# Altium project prj.PrjPCB
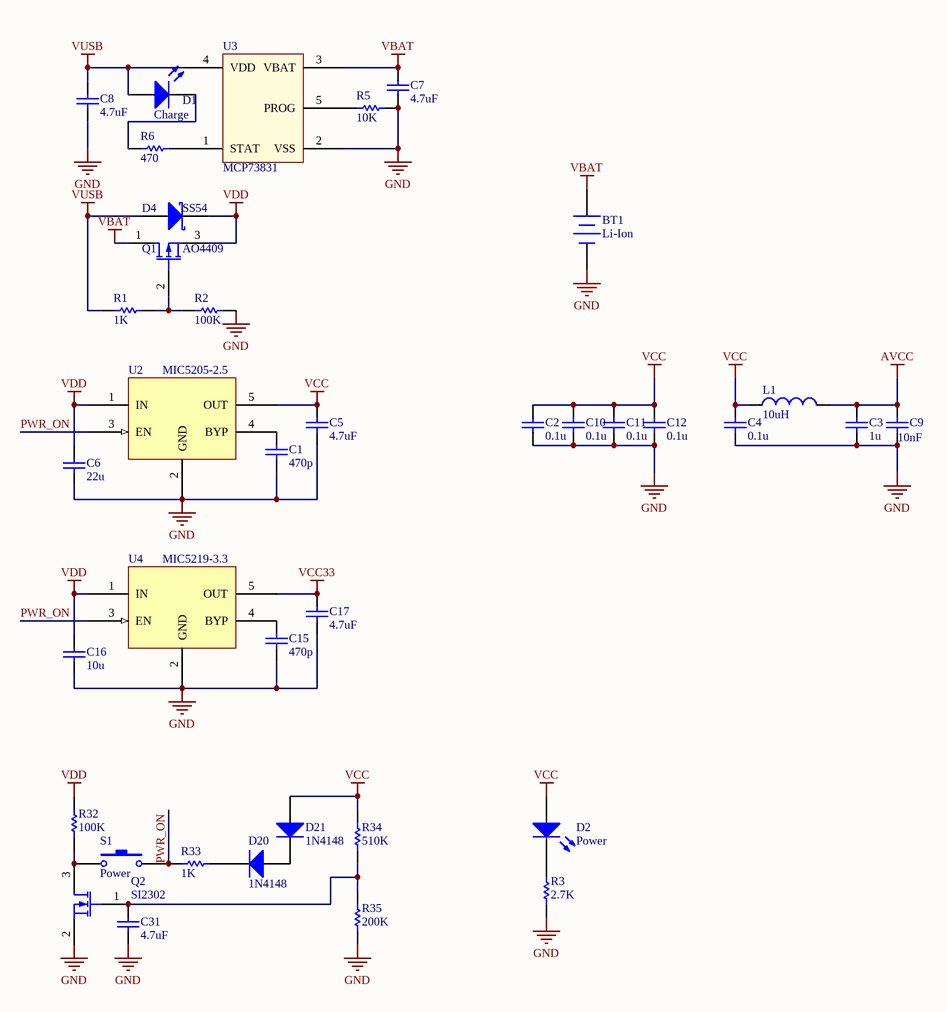
[diagram p0: sch_power.SchDoc]
4 sheets, 104 parts. Net scope: global (net labels, ports and power ports of the same name join across sheets).
Board file: PCB.PcbDoc
Sheets:
  sch_power.SchDoc
  sch_sensor.SchDoc
  sch_output.SchDoc
  sch_mcu.SchDoc

## Sheet sch_power.SchDoc
size A4

### Parts
BT1  Li-Ion  [HDR1X2]
C1  value 470p  [C-1608[0603]]  (hidden comment: Cap Semi)
C2  value 0.1u  [C-1608[0603]]  (hidden comment: Cap Semi)
C3  value 1u  [C-1608[0603]]  (hidden comment: Cap Semi)
C4  value 0.1u  [C-1608[0603]]  (hidden comment: Cap Semi)
C5  value 4.7uF  [C-1608[0603]]  (hidden comment: Cap Semi)
C6  value 22u  [C-2012[0805]]  (hidden comment: Cap Semi)
C7  value 4.7uF  [C-1608[0603]]  (hidden comment: Cap Semi)
C8  value 4.7uF  [C-1608[0603]]  (hidden comment: Cap Semi)
C9  value 10nF  [C-1608[0603]]  (hidden comment: Cap Semi)
C10  value 0.1u  [C-1608[0603]]  (hidden comment: Cap Semi)
C11  value 0.1u  [C-1608[0603]]  (hidden comment: Cap Semi)
C12  value 0.1u  [C-1608[0603]]  (hidden comment: Cap Semi)
C15  value 470p  [C-1608[0603]]  (hidden comment: Cap Semi)
C16  value 10u  [C-2012[0805]]  (hidden comment: Cap Semi)
C17  value 4.7uF  [C-1608[0603]]  (hidden comment: Cap Semi)
C31  value 4.7uF  [C-1608[0603]]  (hidden comment: Cap Semi)
D1  Charge  [LED-1608[0603]-R]
D2  Power  [LED-1608[0603]-G]
D4  SS54  [DO-214AA]
D20  1N4148  [SOD80C]
D21  1N4148  [SOD80C]
L1  value 10uH  [L-1608[0603]]  (hidden comment: Inductor)
Q1  AO4409  [SOP8-MOS]
Q2  SI2302  [SOT23B]
R1  value 1K  [R-1608[0603]]  (hidden comment: Res Semi)
R2  value 100K  [R-1608[0603]]  (hidden comment: Res Semi)
R3  value 2.7K  [R-1608[0603]]  (hidden comment: Res Semi)
R5  value 10K  [R-1608[0603]]  (hidden comment: Res Semi)
R6  value 470  [R-1608[0603]]  (hidden comment: Res Semi)
R32  value 100K  [R-1608[0603]]  (hidden comment: Res Semi)
R33  value 1K  [R-1608[0603]]  (hidden comment: Res Semi)
R34  value 510K  [R-1608[0603]]  (hidden comment: Res Semi)
R35  value 200K  [R-1608[0603]]  (hidden comment: Res Semi)
S1  Power  [TS-015]
U2  MIC5205-2.5  [SOT23-5]
U3  MCP73831  [SOT23-5]
U4  MIC5219-3.3  [SOT23-5]

### Nets
AVCC: C3.2 C9.2 L1.2
GND: BT1.2(-) C1.2 C2.1 C3.1 C4.1 C5.2 C6.2 C7.1 C8.1 C9.1 C10.1 C11.1 C12.1 C15.2 C16.2 C17.2 C31.1 Q2.2(S) R2.2 R3.2 R5.1 R35.1 U2.2(GND) U3.2(VSS) U4.2(GND)
VBAT: BT1.1(+) C7.2 Q1.1(D) U3.3(VBAT)
VCC: C2.2 C4.2 C5.1 C10.2 C11.2 C12.2 D2.1(A) D21.1(A) L1.1 R34.2 U2.5(OUT)
VCC33: C17.1 U4.5(OUT)
VDD: C6.1 C16.1 D4.2(K) Q1.3(S) R32.2 U2.1(IN) U4.1(IN)
VUSB: C8.2 D1.1(A) D4.1(A) R1.1 U3.4(VDD)
PWR_ON: R33.2 S1.2 U2.3(EN) U4.3(EN)
NetC1_1: C1.1 U2.4(BYP)
NetC15_1: C15.1 U4.4(BYP)
NetC31_2: C31.2 Q2.1(G) R34.1 R35.2
NetD1_2: D1.2(K) R6.1
NetD2_2: D2.2(K) R3.1
NetD20_1: D20.1(A) D21.2(K)
NetD20_2: D20.2(K) R33.1
NetQ1_2: Q1.2(G) R1.2 R2.1
NetQ2_3: Q2.3(D) R32.1 S1.1
NetR5_2: R5.2 U3.5(PROG)
NetR6_2: R6.2 U3.1(STAT)

### Library data of the parts
BT1 = Battery: Multicell Battery; Published: 24-Mar-1999; LatestRevisionDate: 17-Jul-2002; LatestRevisionNote: Re-released for DXP Platform.; PackageReference: BAT-2; Publisher: Altium Limited
C1-C12 C15-C17 C31 = Cap Semi: Capacitor (Semiconductor SIM Model); Published: 8-Jun-2000; PackageReference: C1206; Publisher: Altium Limited
  C1 C5 C6 C15-C17: LatestRevisionDate: 29-May-2009; LatestRevisionNote: IPC-7351 Footprint Added.; PackageDescription: Chip Capacitor
  C2-C4 C7-C12 C31: LatestRevisionDate: 17-Jul-2002; LatestRevisionNote: Re-released for DXP Platform.
D1 D2 = LED2: Typical RED, GREEN, YELLOW, AMBER GaAs LED; Published: 8-Jun-2000; LatestRevisionDate: 17-Jul-2002; LatestRevisionNote: Re-released for DXP Platform.; PackageDocument: Feb-2002; PackageReference: 3.2X1.6X1.1; Publisher: Altium Limited
D4 = D Schottky: Schottky Diode; Published: 8-Jun-2000; LatestRevisionDate: 17-Jul-2002; LatestRevisionNote: Re-released for DXP Platform.; Publisher: Altium Limited
D20 D21 = Diode 1N4148: High Conductance Fast Diode; Published: 8-Jun-2000; LatestRevisionDate: 17-Jul-2002; LatestRevisionNote: Re-released for DXP Platform.; DatasheetDocument: 1997; PackageReference: DO-35; Publisher: Altium Limited; Code_JEDEC: DO-204-AH; ComponentLink1Description: Manufacturer Link; ComponentLink1URL: http://www.fairchildsemi.com/; ComponentLink2Description: Datasheet; ComponentLink2URL: http://www.fairchildsemi.com/ds/1N%2F1N4148.pdf
L1 = Inductor: Code_IEC: 1005; Published: 8-Jun-2000; LatestRevisionDate: 17-Jul-2002; LatestRevisionNote: Re-released for DXP Platform.; PackageReference: 0402-A; Publisher: Altium Limited; Code_JEITA: 0402
Q1 = MOSFET-P: P-Channel MOSFET; pin to pad: 1>D 2>G 3>S; PackageDocument: 1995/1996; Published: 8-Jun-2000; LatestRevisionDate: 17-Jul-2002; LatestRevisionNote: Re-released for DXP Platform.; PackageReference: E3; Publisher: Altium Limited
Q2 = SI2302: N-Channel MOSFET; Published: 8-Jun-2000; LatestRevisionDate: 17-Jul-2002; LatestRevisionNote: Re-released for DXP Platform.; PackageVersion: 1995/1996; PackageReference: E3; Publisher: Altium Limited
R1-R3 R5 R6 R32-R35 = Res Semi: Semiconductor Resistor; Published: 8-Jun-2000; LatestRevisionDate: 17-Jul-2002; LatestRevisionNote: Re-released for DXP Platform.; PackageReference: AXIAL-0.5; Publisher: Altium Limited
  R3 R32-R35: PackageDescription: Axial Device, Thru-Hole; 2 Leads; 0.5 in Pin Spacing
S1 = SW-PB: Switch; Published: 24-Mar-1999; LatestRevisionDate: 17-Jul-2002; LatestRevisionNote: Re-released for DXP Platform.; PackageReference: SPST-2; Publisher: Altium Limited
U2 U4 = MIC5219: 500mA-Peak Output LDO Regulator
U3 = MCP73831: Miniature Single-Cell, Fully Integrated Li-Ion, Li-Polymer Charge Management Controllers

## Sheet sch_sensor.SchDoc
size A4
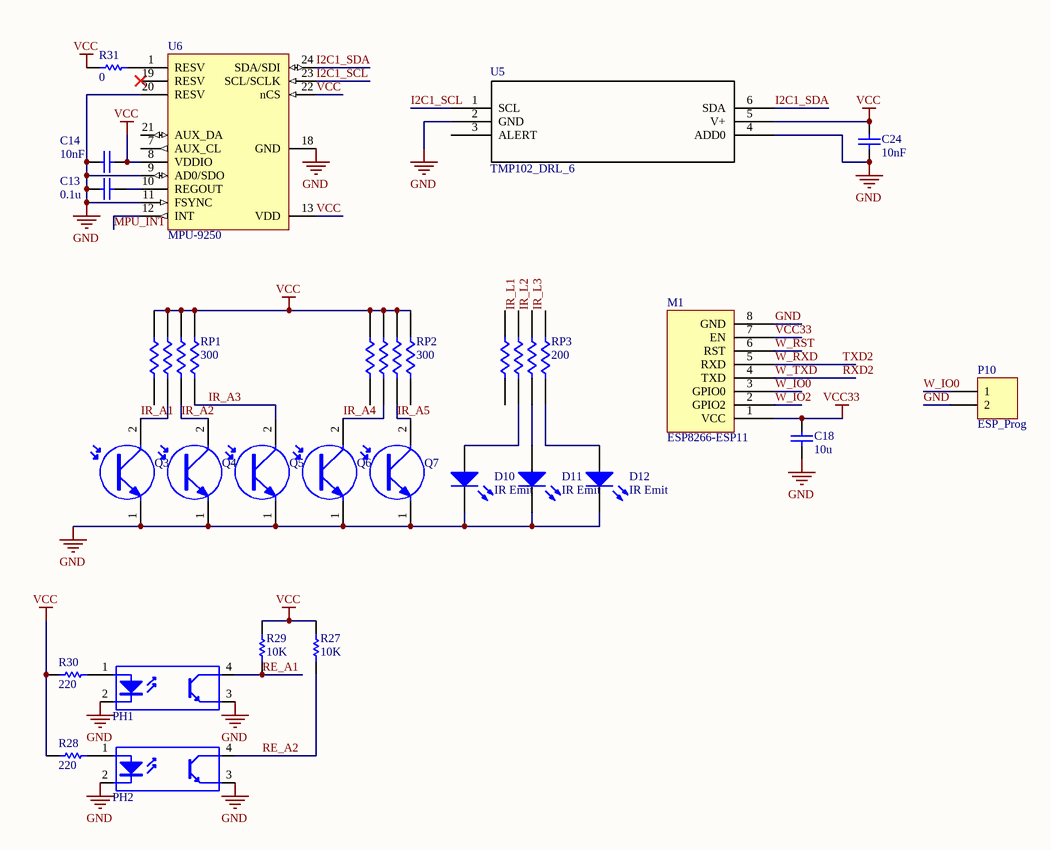
[diagram p1: sch_sensor.SchDoc]

### Parts
C13  value 0.1u  [C-1608[0603]]  (hidden comment: Cap Semi)
C14  value 10nF  [C-1608[0603]]  (hidden comment: Cap Semi)
C18  value 10u  [C-1608[0603]]  (hidden comment: Cap Semi)
C24  value 10nF  [C-1608[0603]]  (hidden comment: Cap Semi)
D10  IR Emit  [LED-0]
D11  IR Emit  [LED-0]
D12  IR Emit  [LED-0]
M1  ESP8266-ESP11  [ESP8266-ESP11]
P10  ESP_Prog  [EDGE_1]
PH1  Optoisolator1  [RPR359F]  (value not drawn)
PH2  Optoisolator1  [RPR359F]  (value not drawn)
Q3  IR_Photo_NPN  [PHOTO_NPN]  (value not drawn)
Q4  IR_Photo_NPN  [PHOTO_NPN]  (value not drawn)
Q5  IR_Photo_NPN  [PHOTO_NPN]  (value not drawn)
Q6  IR_Photo_NPN  [PHOTO_NPN]  (value not drawn)
Q7  IR_Photo_NPN  [PHOTO_NPN]  (value not drawn)
R27  value 10K  [R-1608[0603]]  (hidden comment: Res Semi)
R28  value 220  [R-1608[0603]]  (hidden comment: Res Semi)
R29  value 10K  [R-1608[0603]]  (hidden comment: Res Semi)
R30  value 220  [R-1608[0603]]  (hidden comment: Res Semi)
R31  value 0  [R-1608[0603]]  (hidden comment: Res Semi)
RP1  300  [R0603x4]
RP2  300  [R0603x4]
RP3  200  [R0603x4]
U5  TMP102_DRL_6  [DRL6]
U6  MPU-9250  [MPU9250]

### Nets
GND: C13.2 C14.2 C18.1 C24.2 D10.2(K) D11.2(K) D12.2(K) M1.8(GND) P10.2 PH1.2(K) PH1.3(E) PH2.2(K) PH2.3(E) Q3.1(E) Q4.1(E) Q5.1(E) Q6.1(E) Q7.1(E) U5.2(GND) U5.4(ADD0) U6.9(AD0/SDO) U6.11(FSYNC) U6.18(GND) U6.20(RESV)
VCC: C14.1 C24.1 R27.2 R28.2 R29.2 R30.2 R31.1 RP1.1 RP1.2 RP1.3 RP1.4 RP2.1 RP2.2 RP2.3 RP2.4 U5.5(V+) U6.8(VDDIO) U6.13(VDD) U6.22(nCS)
VCC33: C18.2 M1.1(VCC) M1.7(EN)
I2C1_SCL: U5.1(SCL) U6.23(SCL/SCLK)
I2C1_SDA: U5.6(SDA) U6.24(SDA/SDI)
IR_A1: Q3.2(C) RP1.6
IR_A2: Q4.2(C) RP1.7
IR_A3: Q5.2(C) RP1.8
IR_A4: Q6.2(C) RP2.6
IR_A5: Q7.2(C) RP2.7
IR_L1: RP3.3
IR_L2: RP3.2
IR_L3: RP3.1
MPU_INT: U6.12(INT)
RE_A1: PH1.4(C) R29.1
RE_A2: PH2.4(C) R27.1
RXD2: M1.4(TXD)  [also labelled W_TXD]
TXD2: M1.5(RXD)  [also labelled W_RXD]
W_IO0: M1.3(GPIO0) P10.1
W_IO2: M1.2(GPIO2)
W_RST: M1.6(RST)
NetC13_1: C13.1 U6.10(REGOUT)
NetD10_1: D10.1(A) RP3.6
NetD11_1: D11.1(A) RP3.7
NetD12_1: D12.1(A) RP3.8
NetPH1_1: PH1.1(A) R30.1
NetPH2_1: PH2.1(A) R28.1
NetR31_2: R31.2 U6.1(RESV)

Not connected (* = marked no-connect by the designer): RP1 5; RP2 5 8; RP3 4 5; U5 3(ALERT); U6 7(AUX_CL) 19(RESV)* 21(AUX_DA)

### Library data of the parts
C13 C14 C18 C24 = Cap Semi: Capacitor (Semiconductor SIM Model); Published: 8-Jun-2000; LatestRevisionDate: 17-Jul-2002; LatestRevisionNote: Re-released for DXP Platform.; PackageReference: C1206; Publisher: Altium Limited
D10-D12 = LED0: Typical INFRARED GaAs LED; Published: 8-Jun-2000; LatestRevisionDate: 08-Jul-2005; LatestRevisionNote: Mech Layer 1 removed.; PackageReference: LED-0; Publisher: Altium Limited; PackageDescription: LED; 2 Leads
P10 = Header 2: Header, 2-Pin; LatestRevisionDate: 17-Jul-2002; LatestRevisionNote: Re-released for DXP Platform.; Publisher: Altium Limited
PH1 PH2 = Optoisolator1: 4-Pin Phototransistor Optocoupler; Published: 24-Mar-1999; LatestRevisionDate: 04-Mar-2005; LatestRevisionNote: Sch pins 3 & 4 Swapped.; DatasheetVersion: Nov-2003; PackageReference: DIP-4; Publisher: Altium Limited
Q3-Q7 = IR_Photo_NPN: NPN Phototransistor; Published: 24-Mar-1999; LatestRevisionDate: 17-Jul-2002; LatestRevisionNote: Re-released for DXP Platform.; PackageReference: TO-220_A; Publisher: Altium Limited; Code_JEDEC: TO-220-AC
R27-R31 = Res Semi: Semiconductor Resistor; Published: 8-Jun-2000; LatestRevisionDate: 17-Jul-2002; LatestRevisionNote: Re-released for DXP Platform.; PackageReference: AXIAL-0.5; Publisher: Altium Limited
  R27-R30: PackageDescription: Axial Device, Thru-Hole; 2 Leads; 0.5 in Pin Spacing
RP1-RP3 = RPACK4
U5 = TMP102_DRL_6: Imported; GENERIC_PART_NUMBER: TMP102; Vendor: Texas Instruments; PACKAGE_DESIGNATOR: DRL; PIN_COUNT: 6; FAMILY_NAME: TEMPERATURE SENSOR; INDUSTRY_STD_PKG_TYPE: SOT; Manufacturer_Part_Number: tmp102_drl_6; Datasheet URL: http://www.ti.com/lit/gpn/TMP102; Manufacturer: Texas Instruments; RefDes: RefDes; Type: DEV; Value: Value
U6 = MPU-9250: Integrated 6-axis MotionTracking device
M1 = ESP8266-ESP11: Value: http://item.taobao.com/item.htm?id=41802488823

## Sheet sch_output.SchDoc
size A4
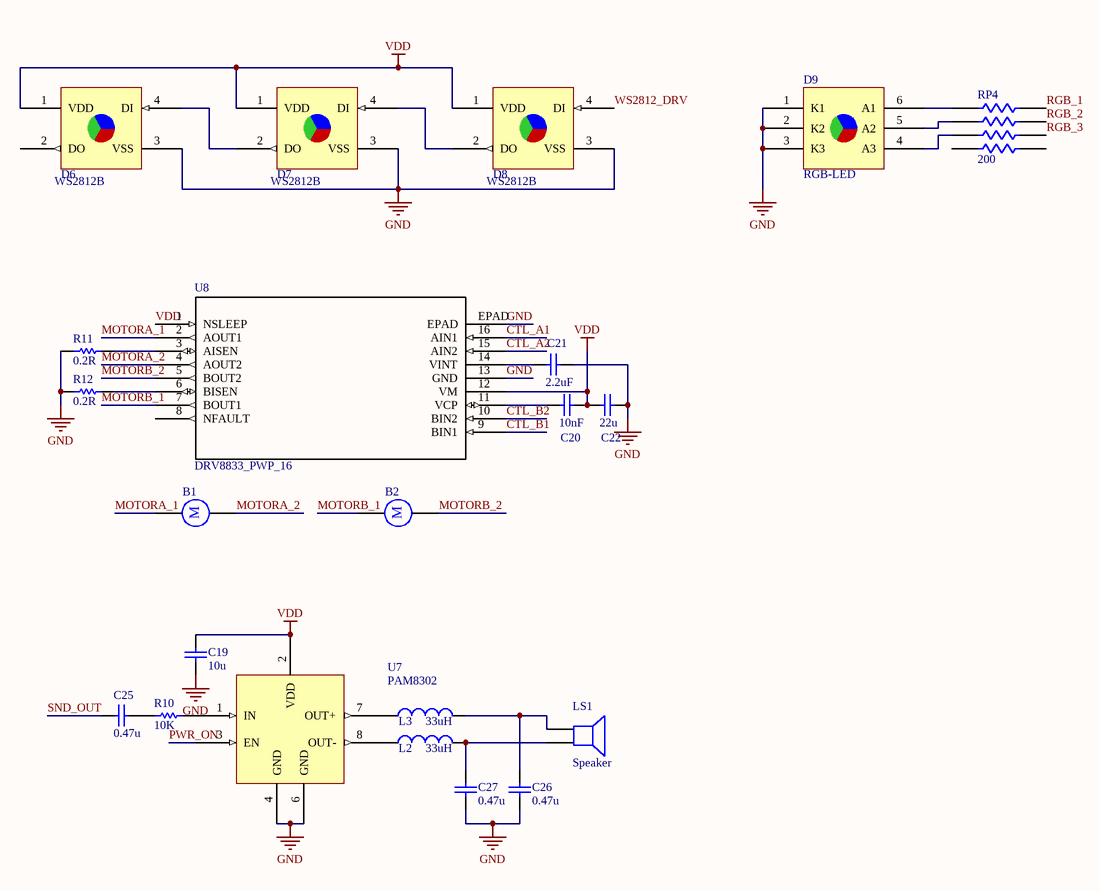
[diagram p2: sch_output.SchDoc]

### Parts
B1  Motor  [RB5-10.5]  (value not drawn)
B2  Motor  [RB5-10.5]  (value not drawn)
C19  value 10u  [C-2012[0805]]  (hidden comment: Cap Semi)
C20  value 10nF  [C-1608[0603]]  (hidden comment: Cap Semi)
C21  value 2.2uF  [C-1608[0603]]  (hidden comment: Cap Semi)
C22  value 22u  [C-2012[0805]]  (hidden comment: Cap Semi)
C25  value 0.47u  [C-1608[0603]]  (hidden comment: Cap Semi)
C26  value 0.47u  [C-1608[0603]]  (hidden comment: Cap Semi)
C27  value 0.47u  [C-1608[0603]]  (hidden comment: Cap Semi)
D6  WS2812B  [LED-5050-4]
D7  WS2812B  [LED-5050-4]
D8  WS2812B  [LED-5050-4]
D9  RGB-LED  [LED-5050-6]
L2  value 33uH  [L-1608[0603]]  (hidden comment: Inductor)
L3  value 33uH  [L-1608[0603]]  (hidden comment: Inductor)
LS1  Speaker  [PIN2]
R10  value 10K  [R-1608[0603]]  (hidden comment: Res Semi)
R11  value 0.2R  [R-3216[1206]]  (hidden comment: Res Semi)
R12  value 0.2R  [R-3216[1206]]  (hidden comment: Res Semi)
RP4  200  [R0603x4]
U7  PAM8302  [SOP8-3D]
U8  DRV8833_PWP_16  [PWP16_2P31X2P46]

### Nets
GND: C19.1 C21.1 C22.2 C26.2 C27.2 D6.3(VSS) D7.3(VSS) D8.3(VSS) D9.1(K1) D9.2(K2) D9.3(K3) R11.1 R12.1 U7.4(GND) U7.6(GND) U8.13(GND) U8.EPAD
VDD: C19.2 C20.1 C22.1 D6.1(VDD) D7.1(VDD) D8.1(VDD) U7.2(VDD) U8.1(NSLEEP) U8.12(VM)
CTL_A1: U8.16(AIN1)
CTL_A2: U8.15(AIN2)
CTL_B1: U8.9(BIN1)
CTL_B2: U8.10(BIN2)
MOTORA_1: B1.1 U8.2(AOUT1)
MOTORA_2: B1.2 U8.4(AOUT2)
MOTORB_1: B2.1 U8.7(BOUT1)
MOTORB_2: B2.2 U8.5(BOUT2)
PWR_ON: U7.3(EN)
RGB_1: RP4.8
RGB_2: RP4.7
RGB_3: RP4.6
SND_OUT: C25.2
WS2812_DRV: D8.4(DI)
NetC20_2: C20.2 U8.11(VCP)
NetC21_2: C21.2 U8.14(VINT)
NetC25_1: C25.1 R10.2
NetC26_1: C26.1 L3.2 LS1.1
NetC27_1: C27.1 L2.2 LS1.2
NetD6_4: D6.4(DI) D7.2(DO)
NetD7_4: D7.4(DI) D8.2(DO)
NetD9_4: D9.4(A3) RP4.3
NetD9_5: D9.5(A2) RP4.2
NetD9_6: D9.6(A1) RP4.1
NetL2_1: L2.1 U7.8(OUT-)
NetL3_1: L3.1 U7.7(OUT+)
NetR10_1: R10.1 U7.1(IN)
NetR11_2: R11.2 U8.3(AISEN)
NetR12_2: R12.2 U8.6(BISEN)

Not connected (* = marked no-connect by the designer): D6 2(DO); RP4 4 5; U8 8(NFAULT)

### Notes on the sheet
- (in symbol Motor) M

### Library data of the parts
B1 B2 = Motor: Motor, General Kind; Published: 24-Mar-1999; LatestRevisionDate: 17-Jul-2002; LatestRevisionNote: Re-released for DXP Platform.; PackageReference: RB5-10.5; Publisher: Altium Limited; PackageDescription: Capacitor (Radial); 2 Leads
C19-C22 C25-C27 = Cap Semi: Capacitor (Semiconductor SIM Model); Published: 8-Jun-2000; PackageReference: C1206; Publisher: Altium Limited
  C19 C22: LatestRevisionDate: 29-May-2009; LatestRevisionNote: IPC-7351 Footprint Added.; PackageDescription: Chip Capacitor
  C20 C21 C25-C27: LatestRevisionDate: 17-Jul-2002; LatestRevisionNote: Re-released for DXP Platform.
D9 = RGBLED
L2 L3 = Inductor: Code_IEC: 1005; Published: 8-Jun-2000; LatestRevisionDate: 17-Jul-2002; LatestRevisionNote: Re-released for DXP Platform.; PackageReference: 0402-A; Publisher: Altium Limited; Code_JEITA: 0402
LS1 = Speaker: Loudspeaker; Published: 24-Mar-1999; LatestRevisionDate: 17-Jul-2002; LatestRevisionNote: Re-released for DXP Platform.; PackageReference: PIN2; Publisher: Altium Limited
R10-R12 = Res Semi: Semiconductor Resistor; Published: 8-Jun-2000; LatestRevisionDate: 17-Jul-2002; LatestRevisionNote: Re-released for DXP Platform.; PackageReference: AXIAL-0.5; Publisher: Altium Limited
RP4 = RPACK4
U8 = DRV8833_PWP_16: Imported; Manufacturer: Texas Instruments; INDUSTRY_STD_PKG_TYPE: HTSSOP; FAMILY_NAME: BRUSHED DC DRIVER; PIN_COUNT: 16; PACKAGE_DESIGNATOR: PWP; Datasheet URL: http://www.ti.com/lit/gpn/DRV8833; GENERIC_PART_NUMBER: DRV8833; Vendor: Texas Instruments; Manufacturer_Part_Number: drv8833_pwp_16; RefDes: RefDes; Type: DEV; Value: Value

## Sheet sch_mcu.SchDoc
size A4
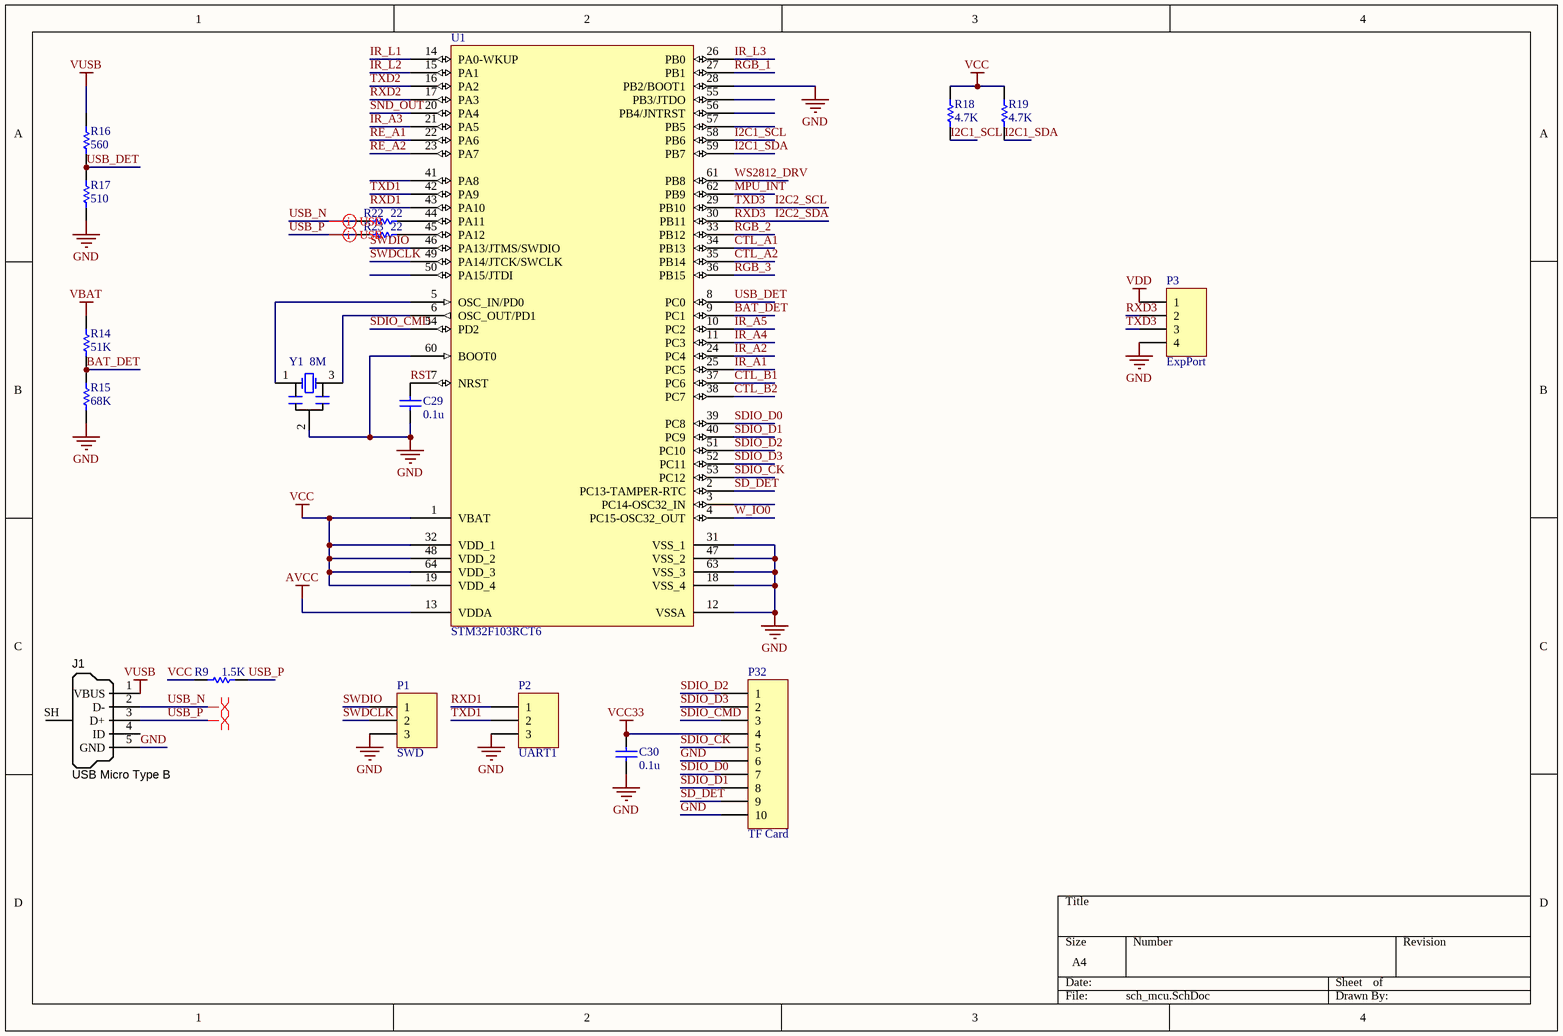
[diagram p3: sch_mcu.SchDoc]

### Parts
C29  value 0.1u  [C-1608[0603]]  (hidden comment: Cap Semi)
C30  value 0.1u  [C-1608[0603]]  (hidden comment: Cap Semi)
J1  USB Micro Type B  [MICRO USB 3D]
P1  SWD  [HDR1X3]
P2  UART1  [HDR1X3]
P3  ExpPort  [HDR1X4]
P32  TF Card  [MicroSD auto]
R9  value 1.5K  [R-1608[0603]]  (hidden comment: Res Semi)
R14  value 51K  [R-1608[0603]]  (hidden comment: Res Semi)
R15  value 68K  [R-1608[0603]]  (hidden comment: Res Semi)
R16  value 560  [R-1608[0603]]  (hidden comment: Res Semi)
R17  value 510  [R-1608[0603]]  (hidden comment: Res Semi)
R18  value 4.7K  [R-1608[0603]]  (hidden comment: Res Semi)
R19  value 4.7K  [R-1608[0603]]  (hidden comment: Res Semi)
R22  value 22  [R-1608[0603]]  (hidden comment: Res Semi)
R23  value 22  [R-1608[0603]]  (hidden comment: Res Semi)
U1  STM32F103RCT6  [TQFP64_N-3D]
Y1  8M  [Crystal_C]

### Nets
AVCC: U1.13(VDDA)
GND: C29.1 C30.1 J1.5(GND) P1.3 P2.3 P3.4 P32.6 P32.10 R15.2 R17.1 U1.12(VSSA) U1.18(VSS_4) U1.28(PB2/BOOT1) U1.31(VSS_1) U1.47(VSS_2) U1.60(BOOT0) U1.63(VSS_3) Y1.2(GND)
VBAT: R14.2
VCC: R9.2 R18.2 R19.2 U1.1(VBAT) U1.19(VDD_4) U1.32(VDD_1) U1.48(VDD_2) U1.64(VDD_3)
VCC33: C30.2 P32.4
VDD: P3.1
VUSB: J1.1(VBUS) R16.2
BAT_DET: R14.1 R15.1 U1.9(PC1)
CTL_A1: U1.34(PB13)
CTL_A2: U1.35(PB14)
CTL_B1: U1.37(PC6)
CTL_B2: U1.38(PC7)
I2C1_SCL: R18.1 U1.58(PB6)
I2C1_SDA: R19.1 U1.59(PB7)
I2C2_SCL: P3.3 U1.29(PB10)  [also labelled TXD3]
I2C2_SDA: P3.2 U1.30(PB11)  [also labelled RXD3]
IR_A1: U1.25(PC5)
IR_A2: U1.24(PC4)
IR_A3: U1.21(PA5)
IR_A4: U1.11(PC3)
IR_A5: U1.10(PC2)
IR_L1: U1.14(PA0-WKUP)
IR_L2: U1.15(PA1)
IR_L3: U1.26(PB0)
MPU_INT: U1.62(PB9)
RE_A1: U1.22(PA6)
RE_A2: U1.23(PA7)
RGB_1: U1.27(PB1)
RGB_2: U1.33(PB12)
RGB_3: U1.36(PB15)
RST: C29.2 U1.7(NRST)
RXD1: P2.1 U1.43(PA10)
RXD2: U1.17(PA3)
SD_DET: P32.9 U1.2(PC13-TAMPER-RTC)
SDIO_CK: P32.5 U1.53(PC12)
SDIO_CMD: P32.3 U1.54(PD2)
SDIO_D0: P32.7 U1.39(PC8)
SDIO_D1: P32.8 U1.40(PC9)
SDIO_D2: P32.1 U1.51(PC10)
SDIO_D3: P32.2 U1.52(PC11)
SND_OUT: U1.20(PA4)
SWDCLK: P1.2 U1.49(PA14/JTCK/SWCLK)
SWDIO: P1.1 U1.46(PA13/JTMS/SWDIO)
TXD1: P2.2 U1.42(PA9)
TXD2: U1.16(PA2)
USB_DET: R16.1 R17.2 U1.8(PC0)
USB_N: J1.2(D-) R22.1
USB_P: J1.3(D+) R9.1 R23.1
W_IO0: U1.4(PC15-OSC32_OUT)
WS2812_DRV: U1.61(PB8)
NetR22_2: R22.2 U1.44(PA11)
NetR23_2: R23.2 U1.45(PA12)
NetU1_5: U1.5(OSC_IN/PD0) Y1.1(OSC1)
NetU1_6: U1.6(OSC_OUT/PD1) Y1.3(OSC2)

Not connected (* = marked no-connect by the designer): J1 4(ID) SH(Shell); U1 3(PC14-OSC32_IN) 41(PA8) 50(PA15/JTDI) 55(PB3/JTDO) 56(PB4/JNTRST) 57(PB5)

### Layout directives
differential pair: USB_N, USB_P

### Library data of the parts
C29 C30 = Cap Semi: Capacitor (Semiconductor SIM Model); Published: 8-Jun-2000; LatestRevisionDate: 17-Jul-2002; LatestRevisionNote: Re-released for DXP Platform.; PackageReference: C1206; Publisher: Altium Limited
J1 = USB_Micro_TypeB: Connector SMD USB Micro Type B middle mount; Manufacturer 1: Molex Inc; Manufacturer Part Number 1: 47491-0001; SCDType: undef; Package / Case: SMD; Supplier 1: Digi-Key; Supplier Part Number 1: WM17142CT-ND
P1 P2 = Header 3: Header, 3-Pin; LatestRevisionDate: 17-Jul-2002; LatestRevisionNote: Re-released for DXP Platform.; Publisher: Altium Limited
P3 = Header 4: Header, 4-Pin; LatestRevisionDate: 17-Jul-2002; LatestRevisionNote: Re-released for DXP Platform.; Publisher: Altium Limited
P32 = Header 10: Header, 10-Pin; LatestRevisionDate: 17-Jul-2002; LatestRevisionNote: Re-released for DXP Platform.; Publisher: Altium Limited
R9 R14-R19 R22 R23 = Res Semi: Semiconductor Resistor; Published: 8-Jun-2000; LatestRevisionDate: 17-Jul-2002; LatestRevisionNote: Re-released for DXP Platform.; PackageReference: AXIAL-0.5; Publisher: Altium Limited
U1 = STM32F103RBT6: STM32 ARM-based 32-bit MCU High-density; Published: 30-May-2008; DatasheetVersion: rev6, Mar-2008; PackageVersion: Mar-2008; PackageReference: LQFP64; Publisher: Altium Limited; PackageDescription: 64-Pin Low-Profile Quad Flat Pack, 10 x 10 mm Body, 0.5 mm Pitch (LQFP64); ComponentLink1Description: Manufacturer Link; ComponentLink1URL: www.st.com/stm32; ComponentLink2Description: Datasheet; ComponentLink2URL: http://www.st.com/stonline/products/literature/ds/13587.pdf
Y1 = XTAL_C: Crystal Oscillator; Published: 8-Jun-2000; LatestRevisionDate: 17-Jul-2002; LatestRevisionNote: Re-released for DXP Platform.; PackageReference: R38; Publisher: Altium Limited

## Nets that join several sheets
AVCC: sch_power (C3.2 C9.2 L1.2), sch_mcu (U1.13)
GND: sch_power (25 pins), sch_sensor (24 pins), sch_output (17 pins), sch_mcu (18 pins)
VBAT: sch_power (BT1.1 C7.2 Q1.1 U3.3), sch_mcu (R14.2)
VCC: sch_power (11 pins), sch_sensor (19 pins), sch_mcu (8 pins)
VCC33: sch_power (C17.1 U4.5), sch_sensor (C18.2 M1.1 M1.7), sch_mcu (C30.2 P32.4)
VDD: sch_power (7 pins), sch_output (9 pins), sch_mcu (P3.1)
VUSB: sch_power (5 pins), sch_mcu (J1.1 R16.2)
CTL_A1: sch_output (U8.16), sch_mcu (U1.34)
CTL_A2: sch_output (U8.15), sch_mcu (U1.35)
CTL_B1: sch_output (U8.9), sch_mcu (U1.37)
CTL_B2: sch_output (U8.10), sch_mcu (U1.38)
I2C1_SCL: sch_sensor (U5.1 U6.23), sch_mcu (R18.1 U1.58)
I2C1_SDA: sch_sensor (U5.6 U6.24), sch_mcu (R19.1 U1.59)
IR_A1: sch_sensor (Q3.2 RP1.6), sch_mcu (U1.25)
IR_A2: sch_sensor (Q4.2 RP1.7), sch_mcu (U1.24)
IR_A3: sch_sensor (Q5.2 RP1.8), sch_mcu (U1.21)
IR_A4: sch_sensor (Q6.2 RP2.6), sch_mcu (U1.11)
IR_A5: sch_sensor (Q7.2 RP2.7), sch_mcu (U1.10)
IR_L1: sch_sensor (RP3.3), sch_mcu (U1.14)
IR_L2: sch_sensor (RP3.2), sch_mcu (U1.15)
IR_L3: sch_sensor (RP3.1), sch_mcu (U1.26)
MPU_INT: sch_sensor (U6.12), sch_mcu (U1.62)
PWR_ON: sch_power (R33.2 S1.2 U2.3 U4.3), sch_output (U7.3)
RE_A1: sch_sensor (PH1.4 R29.1), sch_mcu (U1.22)
RE_A2: sch_sensor (PH2.4 R27.1), sch_mcu (U1.23)
RGB_1: sch_output (RP4.8), sch_mcu (U1.27)
RGB_2: sch_output (RP4.7), sch_mcu (U1.33)
RGB_3: sch_output (RP4.6), sch_mcu (U1.36)
RXD2: sch_sensor (M1.4), sch_mcu (U1.17)
SND_OUT: sch_output (C25.2), sch_mcu (U1.20)
TXD2: sch_sensor (M1.5), sch_mcu (U1.16)
W_IO0: sch_sensor (M1.3 P10.1), sch_mcu (U1.4)
WS2812_DRV: sch_output (D8.4), sch_mcu (U1.61)